# EAGLE design pro_mini_v0.4 (EAGLE 8.4.3)
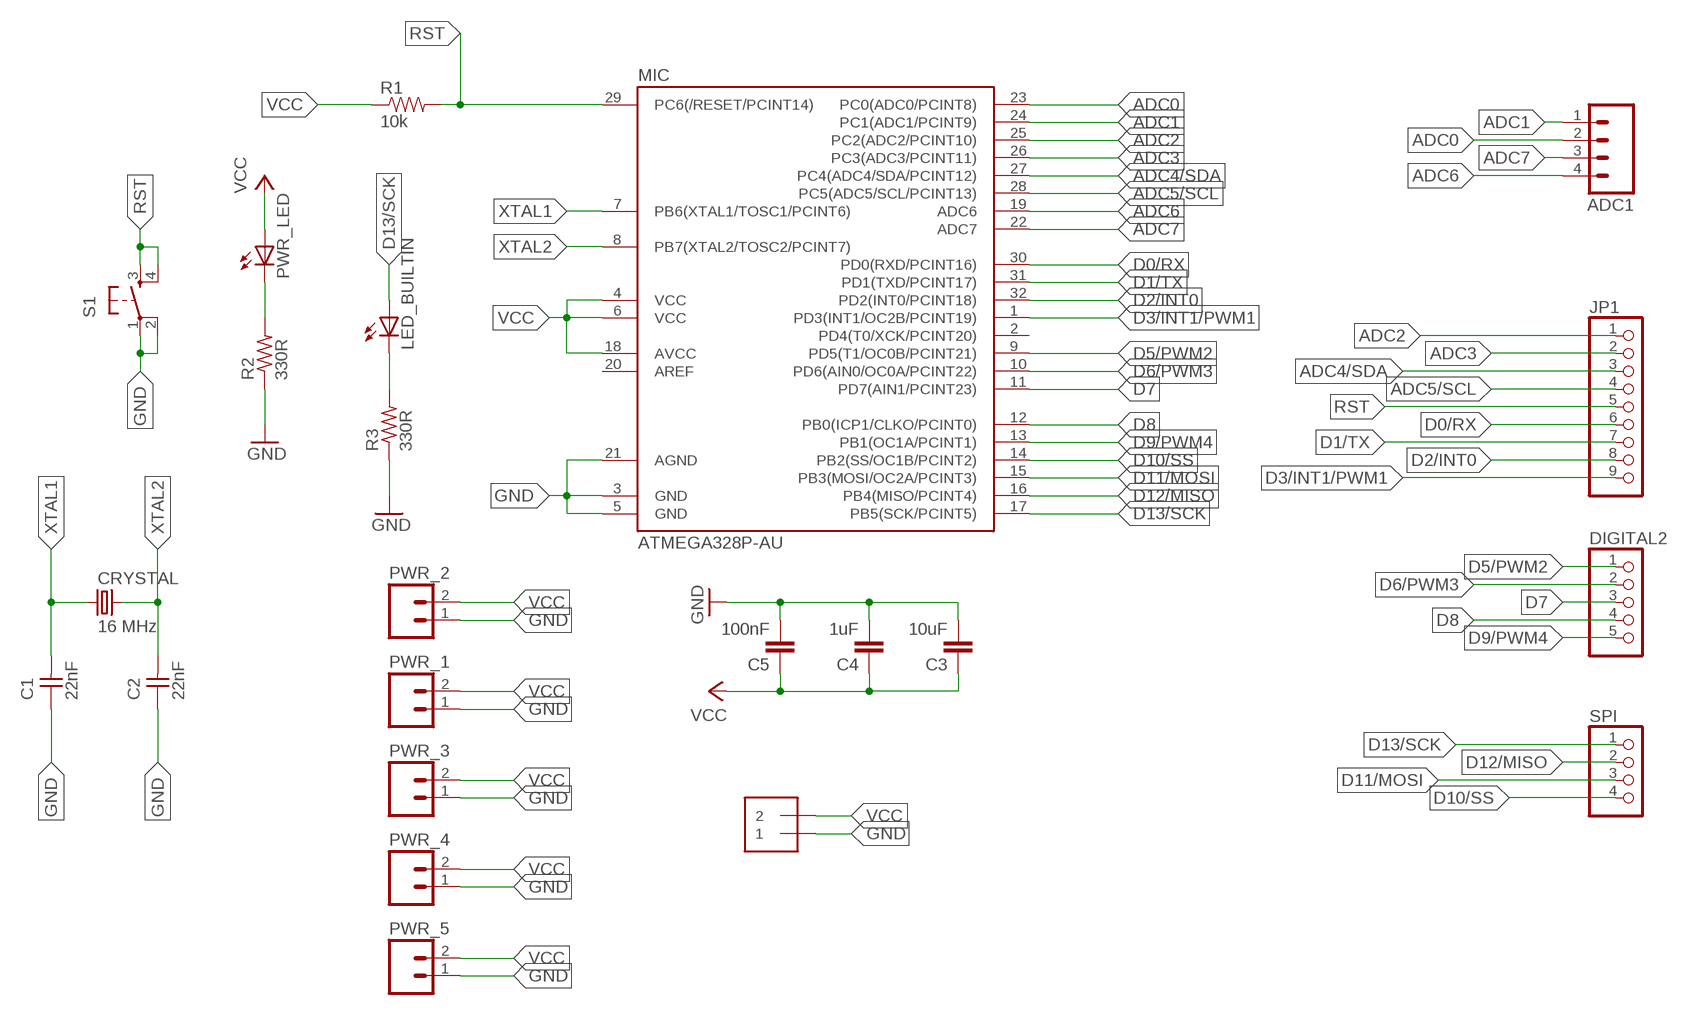
[diagram p0: schematic, sheet 1]

## Parts
ADC1  M04LONGPADS  [1X04_LONGPADS]
C1  22nF  CAP-UNPOLARIZEDFAB  [C1206FAB]
C2  22nF  CAP-UNPOLARIZEDFAB  [C1206FAB]
C3  10uF  CAP1206  [1206]
C4  1uF  CAP1206  [1206]
C5  100nF  CAP1206  [1206]
CRYSTAL  16 MHz  CRYSTAL  [2-SMD-5X3MM]
DIGITAL2  PINHD-1X5  [1X05]
JP1  PINHD-1X9  [1X09]
LED_BUILTIN  LED1206  [1206]
MIC  ATMEGA328P-AU  ATMEGA48/88/168-AU  [TQFP32-08]
PWR_1  M02LOCK_LONGPADS  [1X02_LOCK_LONGPADS]
PWR_2  M02LOCK_LONGPADS  [1X02_LOCK_LONGPADS]
PWR_3  M02LOCK_LONGPADS  [1X02_LOCK_LONGPADS]
PWR_4  M02LOCK_LONGPADS  [1X02_LOCK_LONGPADS]
PWR_5  M02LOCK_LONGPADS  [1X02_LOCK_LONGPADS]
PWR_LED  LED1206  [1206]
R1  10k  RESISTOR1206  [1206]
R2  330R  RESISTOR1206  [1206]
R3  330R  RESISTOR1206  [1206]
S1  6MM_SWITCH6MM_SWITCH  [6MM_SWITCH]
SPI  PINHD-1X4  [1X04]
VIN  1X2-3.5MM  [1X2-3.5MM]

## Nets
ADC0: ADC1.2 MIC.23(PC0(ADC0/PCINT8))
ADC1: ADC1.1 MIC.24(PC1(ADC1/PCINT9))
ADC2: JP1.1 MIC.25(PC2(ADC2/PCINT10))
ADC3: JP1.2 MIC.26(PC3(ADC3/PCINT11))
ADC4/SDA: JP1.3 MIC.27(PC4(ADC4/SDA/PCINT12))
ADC5/SCL: JP1.4 MIC.28(PC5(ADC5/SCL/PCINT13))
ADC6: ADC1.4 MIC.19(ADC6)
ADC7: ADC1.3 MIC.22(ADC7)
D0/RX: JP1.6 MIC.30(PD0(RXD/PCINT16))
D1/TX: JP1.7 MIC.31(PD1(TXD/PCINT17))
D2/INT0: JP1.8 MIC.32(PD2(INT0/PCINT18))
D3/INT1/PWM1: JP1.9 MIC.1(PD3(INT1/OC2B/PCINT19))
D5/PWM2: DIGITAL2.1 MIC.9(PD5(T1/OC0B/PCINT21))
D6/PWM3: DIGITAL2.2 MIC.10(PD6(AIN0/OC0A/PCINT22))
D7: DIGITAL2.3 MIC.11(PD7(AIN1/PCINT23))
D8: DIGITAL2.4 MIC.12(PB0(ICP1/CLKO/PCINT0))
D9/PWM4: DIGITAL2.5 MIC.13(PB1(OC1A/PCINT1))
D10/SS: MIC.14(PB2(SS/OC1B/PCINT2)) SPI.4
D11/MOSI: MIC.15(PB3(MOSI/OC2A/PCINT3)) SPI.3
D12/MISO: MIC.16(PB4(MISO/PCINT4)) SPI.2
D13/SCK: LED_BUILTIN.1(A) MIC.17(PB5(SCK/PCINT5)) SPI.1
GND: C1.1 C2.1 C3.2 C4.2 C5.2 MIC.3(GND) MIC.5(GND) MIC.21(AGND) PWR_1.1 PWR_2.1 PWR_3.1 PWR_4.1 PWR_5.1 R2.1 R3.1 S1.1(P) S1.2(P1) VIN.1
N$2: LED_BUILTIN.2(C) R3.2
N$3: PWR_LED.2(C) R2.2
RST: JP1.5 MIC.29(PC6(/RESET/PCINT14)) R1.2 S1.3(S) S1.4(S1)
VCC: C3.1 C4.1 C5.1 MIC.4(VCC) MIC.6(VCC) MIC.18(AVCC) PWR_1.2 PWR_2.2 PWR_3.2 PWR_4.2 PWR_5.2 PWR_LED.1(A) R1.1 VIN.2
XTAL1: C1.2 CRYSTAL.P$1 MIC.7(PB6(XTAL1/TOSC1/PCINT6))
XTAL2: C2.2 CRYSTAL.P$2 MIC.8(PB7(XTAL2/TOSC2/PCINT7))
Unconnected: MIC.2(PD4(T0/XCK/PCINT20)) MIC.20(AREF)

## Library data of the parts
ADC1 = flight_controller.lbr01_SparkFun:M04: Header 4 Standard 4-pin 0.1" header. Use with straight break away headers (SKU : PRT-00116), right angle break away headers (PRT-00553), swiss pins (PRT-00743), machine pins (PRT-00117), and female headers (PRT-00115). Molex polarized connector foot print use with SKU : PRT-08231 with associated crimp pins and housings.
C1 C2 = fablab:CAP-UNPOLARIZED
C3-C5 = 01_SparkFun:CAP: Capacitor Standard 0603 ceramic capacitor, and 0.1" leaded capacitor.
CRYSTAL = fablab:CRYSTAL
DIGITAL2 = pinhead:PINHD-1X5: PIN HEADER
JP1 = pinhead:PINHD-1X9: PIN HEADER
LED_BUILTIN PWR_LED = FAB_Hello:LED
MIC = atmega8:ATMEGA48/88/168
PWR_1-PWR_5 = flight_controller.lbr01_SparkFun:M02: Header 2 Standard 2-pin 0.1" header. Use with straight break away headers (SKU : PRT-00116), right angle break away headers (PRT-00553), swiss pins (PRT-00743), machine pins (PRT-00117), and female headers (PRT-00115). Molex polarized connector foot print use with SKU : PRT-08233 with associated crimp pins and housings.
R1 = 01_SparkFun:RESISTOR: Resistor Basic schematic elements and footprints for 0603, 1206, and PTH 1/10th watt (small) resistors.
R2 R3 = FAB_Hello:RESISTOR
S1 = fablab:6MM_SWITCH: OMRON SWITCH
SPI = pinhead:PINHD-1X4: PIN HEADER
VIN = adafruit:1X2: 3.5mm Terminal block http://www.ladyada.net/library/pcb/eaglelibrary.html

## Board
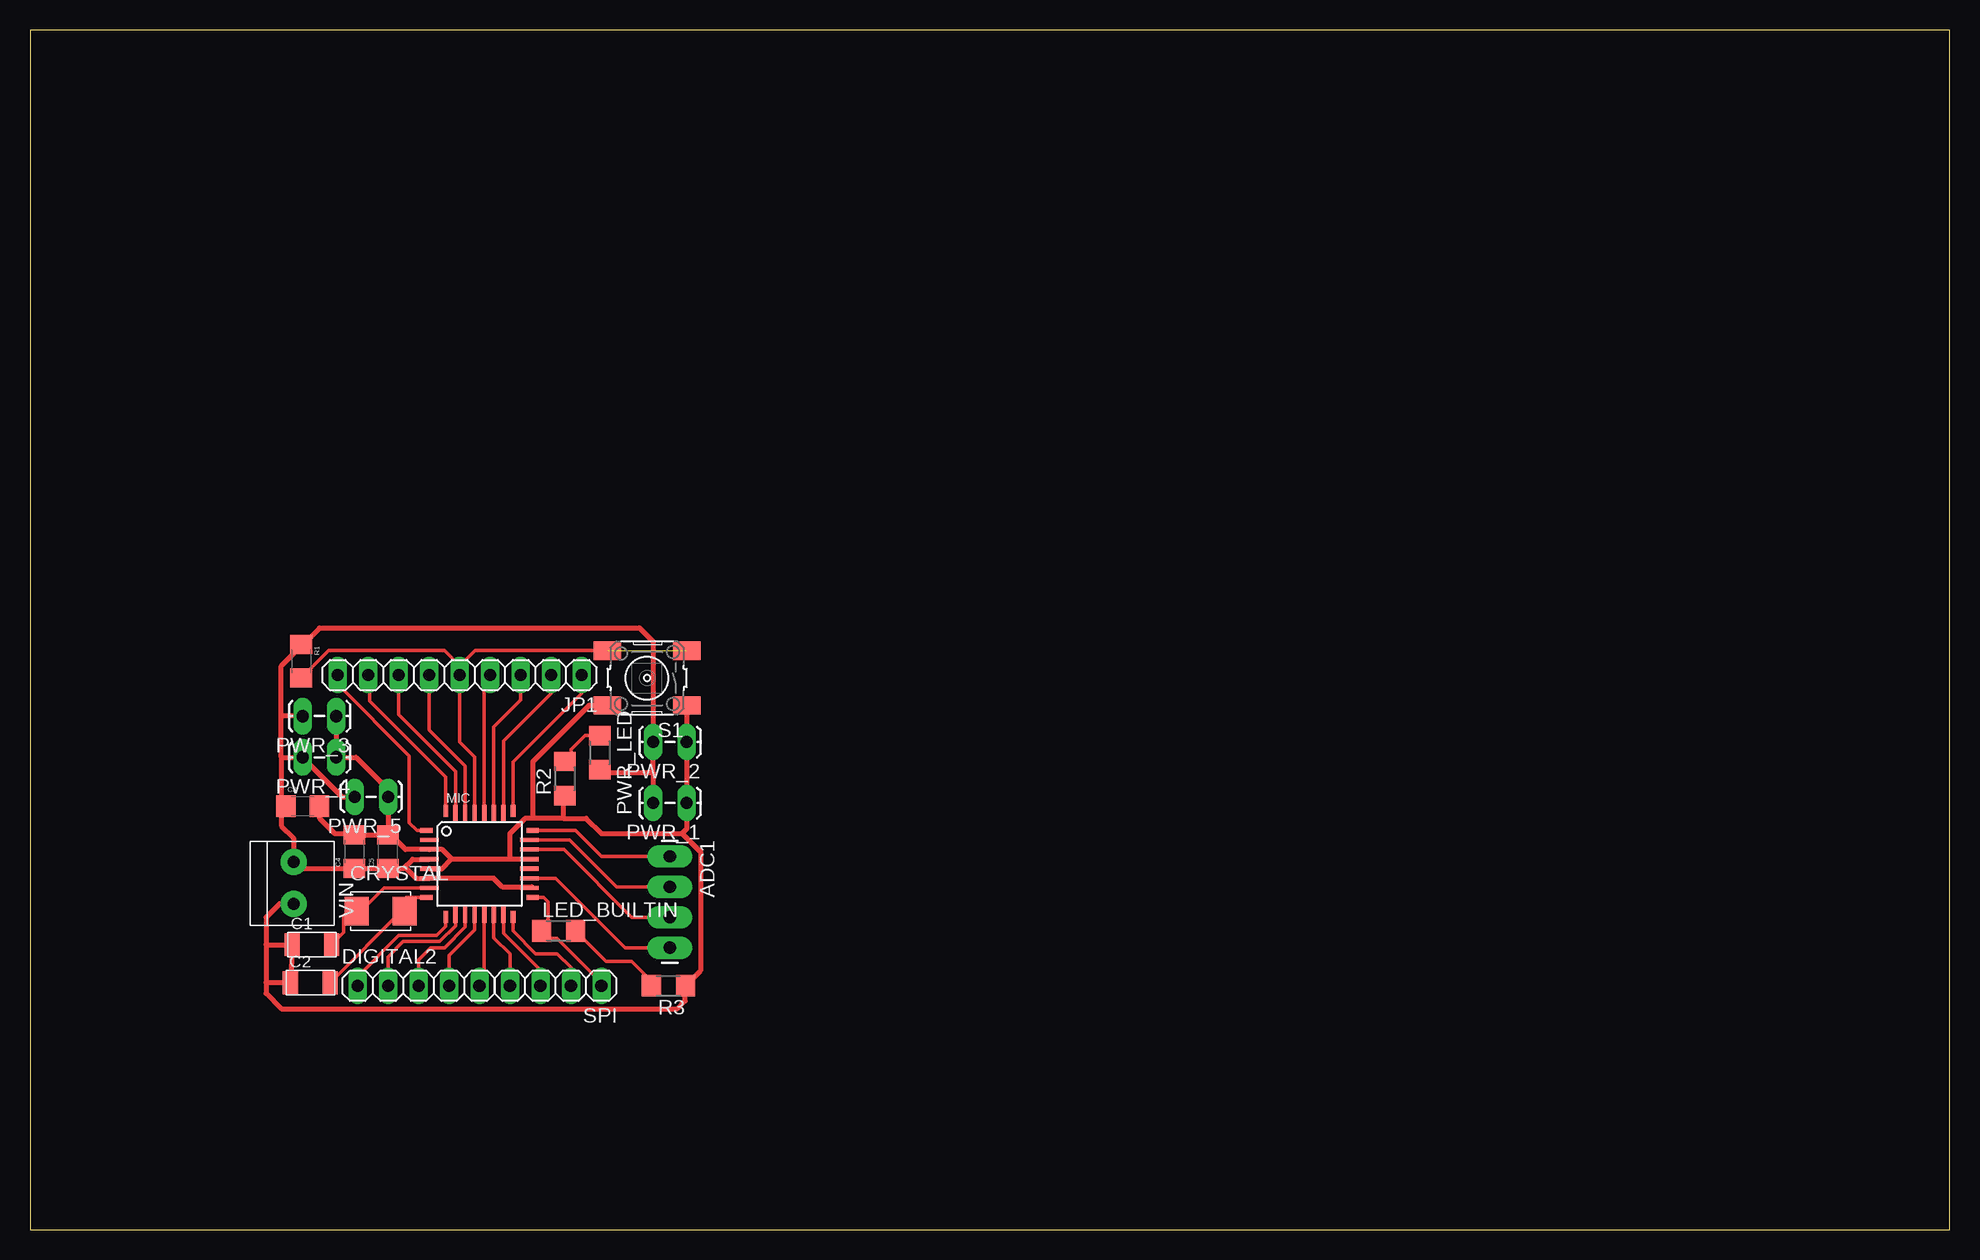
[diagram p1: board, top side]

Size 160 x 100 mm. Coordinates in mm from the lower left corner, seen from the top.
Outline: 0,0 160,0 160,100 0,100 0,0
Copper layers (1*16): Top 0.035mm / dielectric 1.5mm / Bottom 0.035mm
Design rules "default": minimum track width 6mil, minimum drill 0.35mm, track to track 6mil, track to pad 6mil, pad to pad 6mil, via to via 6mil, smd to smd 6mil, copper to edge 40mil, drill to drill 6mil, minimum pad ring 10mil, minimum via ring 8mil, stop-mask expansion 4mil, vias tented up to drill 0mil, thermal gap 10mil

### Footprints (pad centres in the part's own frame; a part is rotated, then mirrored left to right if it is on the bottom)
1X04_LONGPADS = drill 1.016 pad 1.88 long: 1 0,0; 2 2.54,0; 3 5.08,0; 4 7.62,0
C1206FAB = smd 1.27 x 1.905: 1 -1.651,0; 2 1.651,0
1206 = smd 1.6 x 1.8: 1 -1.4,0; 2 1.4,0
2-SMD-5X3MM = smd 2 x 2.4: P$1 -2,0; P$2 2,0
1X05 = drill 1.016 long: 1 -5.08,0; 2 -2.54,0; 3 0,0; 4 2.54,0; 5 5.08,0
1X09 = drill 1.016 long: 1 -10.16,0; 2 -7.62,0; 3 -5.08,0; 4 -2.54,0; 5 0,0; 6 2.54,0; 7 5.08,0; 8 7.62,0; 9 10.16,0
1206' = smd 1.6 x 1.803: 1 -1.422,0; 2 1.422,0
TQFP32-08 = smd 1.016 x 0.406: 1 -4.42,2.8; 8 -4.42,-2.8; 17 4.42,-2.8; 24 4.42,2.8 | smd 1.524 x 0.356: 2 -4.166,2; 3 -4.166,1.2; 4 -4.166,0.4; 5 -4.166,-0.4; 6 -4.166,-1.2; 7 -4.166,-2; 18 4.166,-2; 19 4.166,-1.2; 20 4.166,-0.4; 21 4.166,0.4; 22 4.166,1.2; 23 4.166,2 | smd 0.406 x 1.016: 9 -2.8,-4.42; 16 2.8,-4.42; 25 2.8,4.42; 32 -2.8,4.42 | smd 0.356 x 1.524: 10 -2,-4.166; 11 -1.2,-4.166; 12 -0.4,-4.166; 13 0.4,-4.166; 14 1.2,-4.166; 15 2,-4.166; 26 2,4.166; 27 1.2,4.166; 28 0.4,4.166; 29 -0.4,4.166; 30 -1.2,4.166; 31 -2,4.166
1X02_LOCK_LONGPADS = drill 1.016 long: 1 -0.127,0; 2 2.667,0
6MM_SWITCH = smd 2.286 x 1.524: 1 -3.302,2.286; 2 3.302,2.286; 3 -3.302,-2.286; 4 3.302,-2.286
1X04 = drill 1.016 long: 1 -3.81,0; 2 -1.27,0; 3 1.27,0; 4 3.81,0
1X2-3.5MM = drill 1 pad 2.184: 1 1.8,0; 2 -1.7,0

### Placement (x,y rotation side)
ADC1  53.34,31.11 270 top
C1  23.5,23.75 0 top
C2  23.37,20.57 0 top
C3  22.73,35.31 0 top
C4  27.05,31.5 90 top
C5  29.84,31.5 90 top
CRYSTAL  29.21,26.54 0 top
DIGITAL2  32.38,20.32 0 top
JP1  35.81,46.23 180 top
LED_BUILTIN  [1206']  44.07,24.89 0 top
MIC  37.47,30.48 0 top
PWR_1  54.61,35.56 180 top
PWR_2  54.61,40.64 180 top
PWR_3  25.4,42.8 180 top
PWR_4  25.4,39.37 180 top
PWR_5  29.72,36.07 180 top
PWR_LED  [1206']  47.5,39.75 90 top
R1  22.61,47.37 270 top
R2  330R  [1206']  44.58,37.59 90 top
R3  330R  [1206']  53.21,20.32 180 top
S1  51.44,45.97 180 top
SPI  43.81,20.32 180 top
VIN  21.97,28.96 270 top

### Tracks (layer width: path | path; a pad name or v marks a point on that pad's centre or on a via)
ADC0
  Top 0.305: MIC.23 44.99,32.48 48.9,28.57 ADC1.2 52.07,28.57
ADC1
  Top 0.305: MIC.24 45.46,33.28 47.62,31.11 ADC1.1
ADC2
  Top 0.305: MIC.25 40.27,38.99 45.97,44.7 JP1.1
ADC3
  Top 0.305: JP1.2 43.43,44.7 39.47,40.73 MIC.26
ADC4/SDA
  Top 0.305: JP1.3 40.89,44.14 38.66,41.91 MIC.27
ADC5/SCL
  Top 0.305: MIC.28 37.87,39.37 | 37.87,39.37 37.87,39.6 | 37.87,39.37 37.87,45.74 JP1.4
ADC6
  Top 0.305: MIC.19 43.81,29.28 49.6,23.5 ADC1.4
ADC7
  Top 0.305: MIC.22 44.52,31.68 50.16,26.04 ADC1.3
D0/RX
  Top 0.305: MIC.30 36.27,38.66 33.27,41.66 JP1.6
D1/TX
  Top 0.305: MIC.31 35.47,38.2 30.73,42.93 JP1.7
D2/INT0
  Top 0.305: 34.66,36.07 34.66,36.45 | 34.66,36.07 MIC.32 | JP1.8 28.32,46.1 28.32,44.07 34.66,37.73 34.66,36.07
D3/INT1/PWM1
  Top 0.305: MIC.1 32.25,33.28 31.62,33.91 31.62,39.5 25.65,45.47 JP1.9
D5/PWM2
  Top 0.305: MIC.9 34.66,25.27 33.91,24.51 30.73,24.51 27.3,21.08 DIGITAL2.1
D6/PWM3
  Top 0.305: 35.43,26.28 MIC.10 35.47,25.3 34.16,24 31.11,24 29.84,22.73 DIGITAL2.2
D7
  Top 0.305: MIC.11 36.27,25.22 34.54,23.5 33.4,23.5 32.38,22.48 DIGITAL2.3
D8
  Top 0.305: MIC.12 37.06,25 34.92,22.86 DIGITAL2.4
D9/PWM4
  Top 0.305: 37.85,26.3 MIC.13 37.87,20.72 DIGITAL2.5
D10/SS
  Top 0.305: SPI.4 40.01,22.99 38.66,24.33 MIC.14
D11/MOSI
  Top 0.305: MIC.15 39.47,24.67 42.55,21.59 SPI.3
D12/MISO
  Top 0.305: MIC.16 40.27,24.89 42.16,22.99 43.94,22.99 45.09,21.84 SPI.2
D13/SCK
  Top 0.305: MIC.17 42.8,27.68 43.18,27.3 43.18,25.43 | 42.91,25.16 43.18,25.43 | 42.91,25.16 LED_BUILTIN.1 43.28,24.26 43.94,24.26 47.62,20.57 SPI.1 | 43.18,25.43 42.91,25.16
GND
  Top 0.305: 30.48,32.51 30.48,32.52 | S1.2 47.24,43.81
  Top 0.406: 35.18,30.86 35.16,30.88 | 35.16,30.88 34.36,31.68 MIC.3 31.31,31.68 30.48,32.51 | 35.16,30.88 40.01,30.88 | 40.01,30.88 MIC.21 | 40.01,30.88 40.01,33.02 41.27,34.29 41.91,34.29 | 44.45,34.29 41.91,34.29 | 44.45,34.29 46.35,34.29 47.62,33.02 54.36,33.02 | 54.36,33.02 54.74,33.4 PWR_1.1 PWR_2.1 S1.1 | 27.3,32.9 C5.2 | 27.3,32.9 C4.2 | 30.48,32.52 C5.2 | S1.2 46.61,43.69 41.91,38.99 41.91,34.29 | MIC.5 34.36,30.08 35.16,30.88 | 54.36,33.02 55.88,31.5 55.88,21.57 R3.1 54.61,20.3 54.61,19.05 53.98,18.41 20.95,18.41 19.68,19.68 19.68,20.57 | R2.1 44.45,36.04 44.45,34.29 | PWR_3.1 PWR_4.1 27.18,39.37 29.84,36.7 PWR_5.1 C5.2 | 19.68,23.75 C1.1 C2.1 19.68,20.57 | C3.2 24.13,34.29 25.4,33.02 27.18,33.02 27.3,32.9 | 19.68,23.75 19.68,20.57 | VIN.1 20.81,27.16 19.68,26.04 19.68,23.75
N$2
  Top 0.305: LED_BUILTIN.2 48.03,22.35 50.16,22.35 51.79,20.73 R3.2
N$3
  Top 0.305: R2.2 45.09,39.52 45.09,40.01 46.25,41.17 PWR_LED.2
RST  (1 unrouted)
  Top 0.305: MIC.29 37.06,39.39 35.81,40.64 JP1.5 35.81,46.99 | 35.81,46.99 34.54,48.26 24.89,48.26 R1.2 | 35.81,46.99 37.08,48.26 S1.4
VCC
  Top 0.305: MIC.18 41.91,28.48 41.81,28.57 | C5.1 29.98,30.48 | 33.28,30.86 MIC.4 | 31.11,30.1 31.37,30.1
  Top 0.406: 41.81,28.57 39.37,28.57 38.66,29.28 MIC.6 32.19,29.28 31.37,30.1 | 33.28,30.86 31.88,30.86 31.11,30.1 C5.1 C4.1 22.53,30.1 VIN.2 21.97,32.64 20.95,33.66 20.95,35.56 | 51.94,38.1 PWR_1.2 | 51.94,38.1 PWR_2.2 51.94,49.02 50.8,50.16 24.13,50.16 22.61,48.64 | 22.61,48.64 20.95,46.99 20.95,42.8 | 20.95,39.37 20.95,42.8 | PWR_LED.1 47.73,38.1 51.94,38.1 | PWR_3.2 20.95,42.8 | 20.95,39.37 PWR_4.2 26.04,36.07 PWR_5.2 | R1.1 22.61,48.64 | 20.95,39.37 20.95,35.56 | C3.1 21.08,35.56 20.95,35.56
XTAL1
  Top 0.305: 26.93,26.68 27.14,26.58 | 26.93,26.68 26.67,26.8 | 27.14,26.58 CRYSTAL.P$1 27.3,26.29 | MIC.7 29.53,28.48 27.72,26.68 26.93,26.68 | C1.2 26.16,24.77 26.16,26.16 26.58,26.58 27.14,26.58
XTAL2
  Top 0.305: CRYSTAL.P$2 31.34,27.65 31.37,27.69 MIC.8 | 30.73,26.29 CRYSTAL.P$2 | C2.2 30.99,26.54 CRYSTAL.P$2